# EAGLE design headstage (EAGLE 5.06)
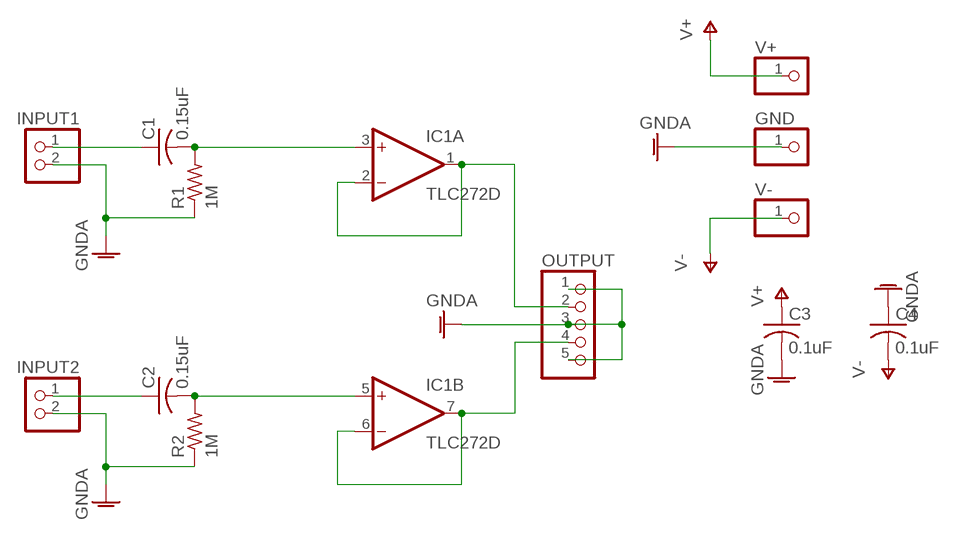
[diagram p0: schematic, sheet 1]

## Parts
C1  0.15uF  C-USC0805  [C0805]
C2  0.15uF  C-USC0805  [C0805]
C3  0.1uF  C-USC0805  [C0805]
C4  0.1uF  C-USC0805  [C0805]
GND  PINHD-1X1  [1X01]
IC1  TLC272D  [SO08]
INPUT1  PINHD-1X2  [1X02]
INPUT2  PINHD-1X2  [1X02]
OUTPUT  PINHD-1X5  [1X05]
R1  1M  R-US_M1206  [M1206]
R2  1M  R-US_M1206  [M1206]
V+  PINHD-1X1  [1X01]
V-  PINHD-1X1  [1X01]

## Nets
GNDA: C3.2 C4.1 GND.1 INPUT1.2 INPUT2.2 OUTPUT.1 OUTPUT.3 OUTPUT.5 R1.1 R2.1
N$1: C1.2 IC1.3(A:+IN) R1.2
N$2: C2.2 IC1.5(B:+IN) R2.2
N$3: IC1.1(A:OUT) IC1.2(A:-IN) OUTPUT.2
N$4: IC1.6(B:-IN) IC1.7(B:OUT) OUTPUT.4
N$5: C2.1 INPUT2.1
N$7: C1.1 INPUT1.1
V+: C3.1 V+.1
V-: C4.2 V-.1

## Power pins joined to a net without a drawn wire
V+: IC1.8(P:V+)
V-: IC1.4(P:V-)

## Library data of the parts
C1-C4 = resistor:C-US: CAPACITOR, American symbol
GND V+ V- = pinhead:PINHD-1X1: PIN HEADER
IC1 = linear:TLC272: OP AMP
INPUT1 INPUT2 = pinhead:PINHD-1X2: PIN HEADER
OUTPUT = pinhead:PINHD-1X5: PIN HEADER
R1 R2 = resistor:R-US_: RESISTOR, American symbol

## Board
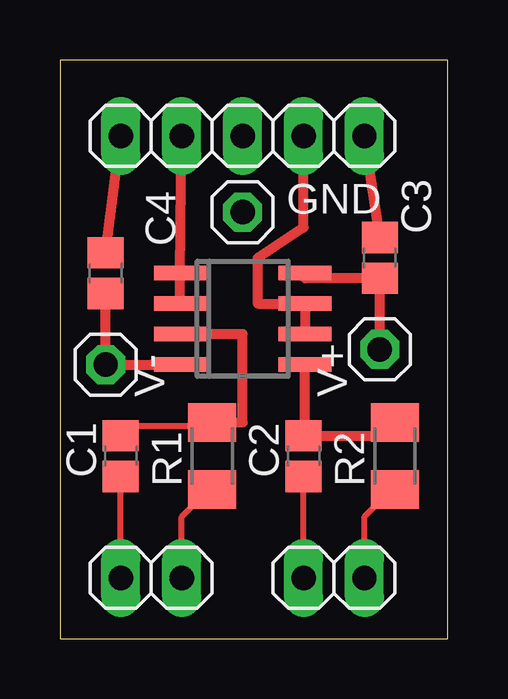
[diagram p1: board, top side]
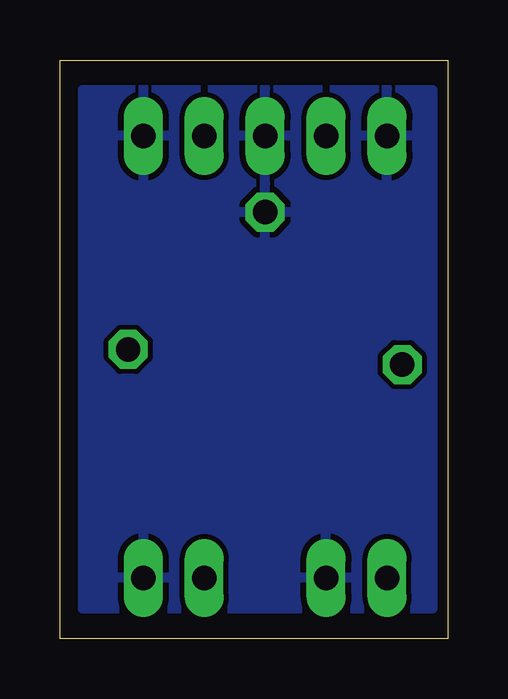
[diagram p2: board, bottom side, seen from below]

Size 16.18 x 24.12 mm. Coordinates in mm from the lower left corner, seen from the top.
Outline: 0,0 16.18,0 16.18,24.12 0,24.12 0,0
Copper layers (1*16): Top 0.035mm / dielectric 1.5mm / Bottom 0.035mm
Design rules "SparkFun": minimum track width 8mil, minimum drill 20mil, track to track 8mil, track to pad 8mil, pad to pad 8mil, via to via 8mil, smd to smd 8mil, copper to edge 10mil, drill to drill 8mil, minimum pad ring 12mil, minimum via ring 10mil, stop-mask expansion 4mil, vias tented up to drill 25mil, thermal gap 10mil

### Footprints (pad centres in the part's own frame; a part is rotated, then mirrored left to right if it is on the bottom)
C0805 = smd 1.3 x 1.5: 1 -0.85,0; 2 0.85,0
1X01 = drill 1.016 octagon: 1 0,0
SO08 = smd 0.6 x 2.2: 1 -1.905,-2.6; 2 -0.635,-2.6; 3 0.635,-2.6; 4 1.905,-2.6; 5 1.905,2.6; 6 0.635,2.6; 7 -0.635,2.6; 8 -1.905,2.6
1X02 = drill 1.016 long: 1 -1.27,0; 2 1.27,0
1X05 = drill 1.016 long: 1 -5.08,0; 2 -2.54,0; 3 0,0; 4 2.54,0; 5 5.08,0
M1206 = smd 1.6 x 2: 1 -1.4,0; 2 1.4,0

### Placement (x,y rotation side)
C1  2.54,7.62 90 top
C2  10.16,7.62 90 top
C3  13.34,15.88 90 top
C4  1.91,15.24 270 top
GND  7.62,17.78 0 top
IC1  7.62,13.34 270 top
INPUT1  3.81,2.54 0 top
INPUT2  11.43,2.54 0 top
OUTPUT  7.62,20.95 0 top
R1  6.35,7.62 90 top
R2  13.97,7.62 90 top
V+  13.34,12.06 0 top
V-  1.91,11.43 0 top

### Tracks (layer width: path | path; a pad name or v marks a point on that pad's centre or on a via)
GNDA
  Top 0.254: INPUT2.2 12.7,5.08 13.97,6.35 R2.1 | INPUT1.2 5.08,5.08 6.35,6.35 R1.1
  Top 0.406: C4.1 OUTPUT.1 | C3.2 OUTPUT.5
  pour Bottom: 0.64,22.86 15.24,22.86 15.24,1.27 0.64,1.27
N$1
  Top 0.254: C1.2 2.54,8.89 6.35,8.89 R1.2
  Top 0.406: R1.2 7.62,9.02 7.62,12.7 IC1.3
N$2
  Top 0.406: R2.2 13.97,8.47 C2.2 10.22,8.47 IC1.5
N$3
  Top 0.406: IC1.2 IC1.1 OUTPUT.2
N$4
  Top 0.406: IC1.6 IC1.7 8.26,13.97 8.26,15.88 10.16,17.14 OUTPUT.4
N$5
  Top 0.254: INPUT2.1 C2.1
N$7
  Top 0.254: INPUT1.1 C1.1
V+
  Top 0.406: V+.1 C3.1 10.22,15.03 IC1.8
V-
  Top 0.406: IC1.4 V-.1 C4.2